# Altium project DOAN1_V2.PrjPcb
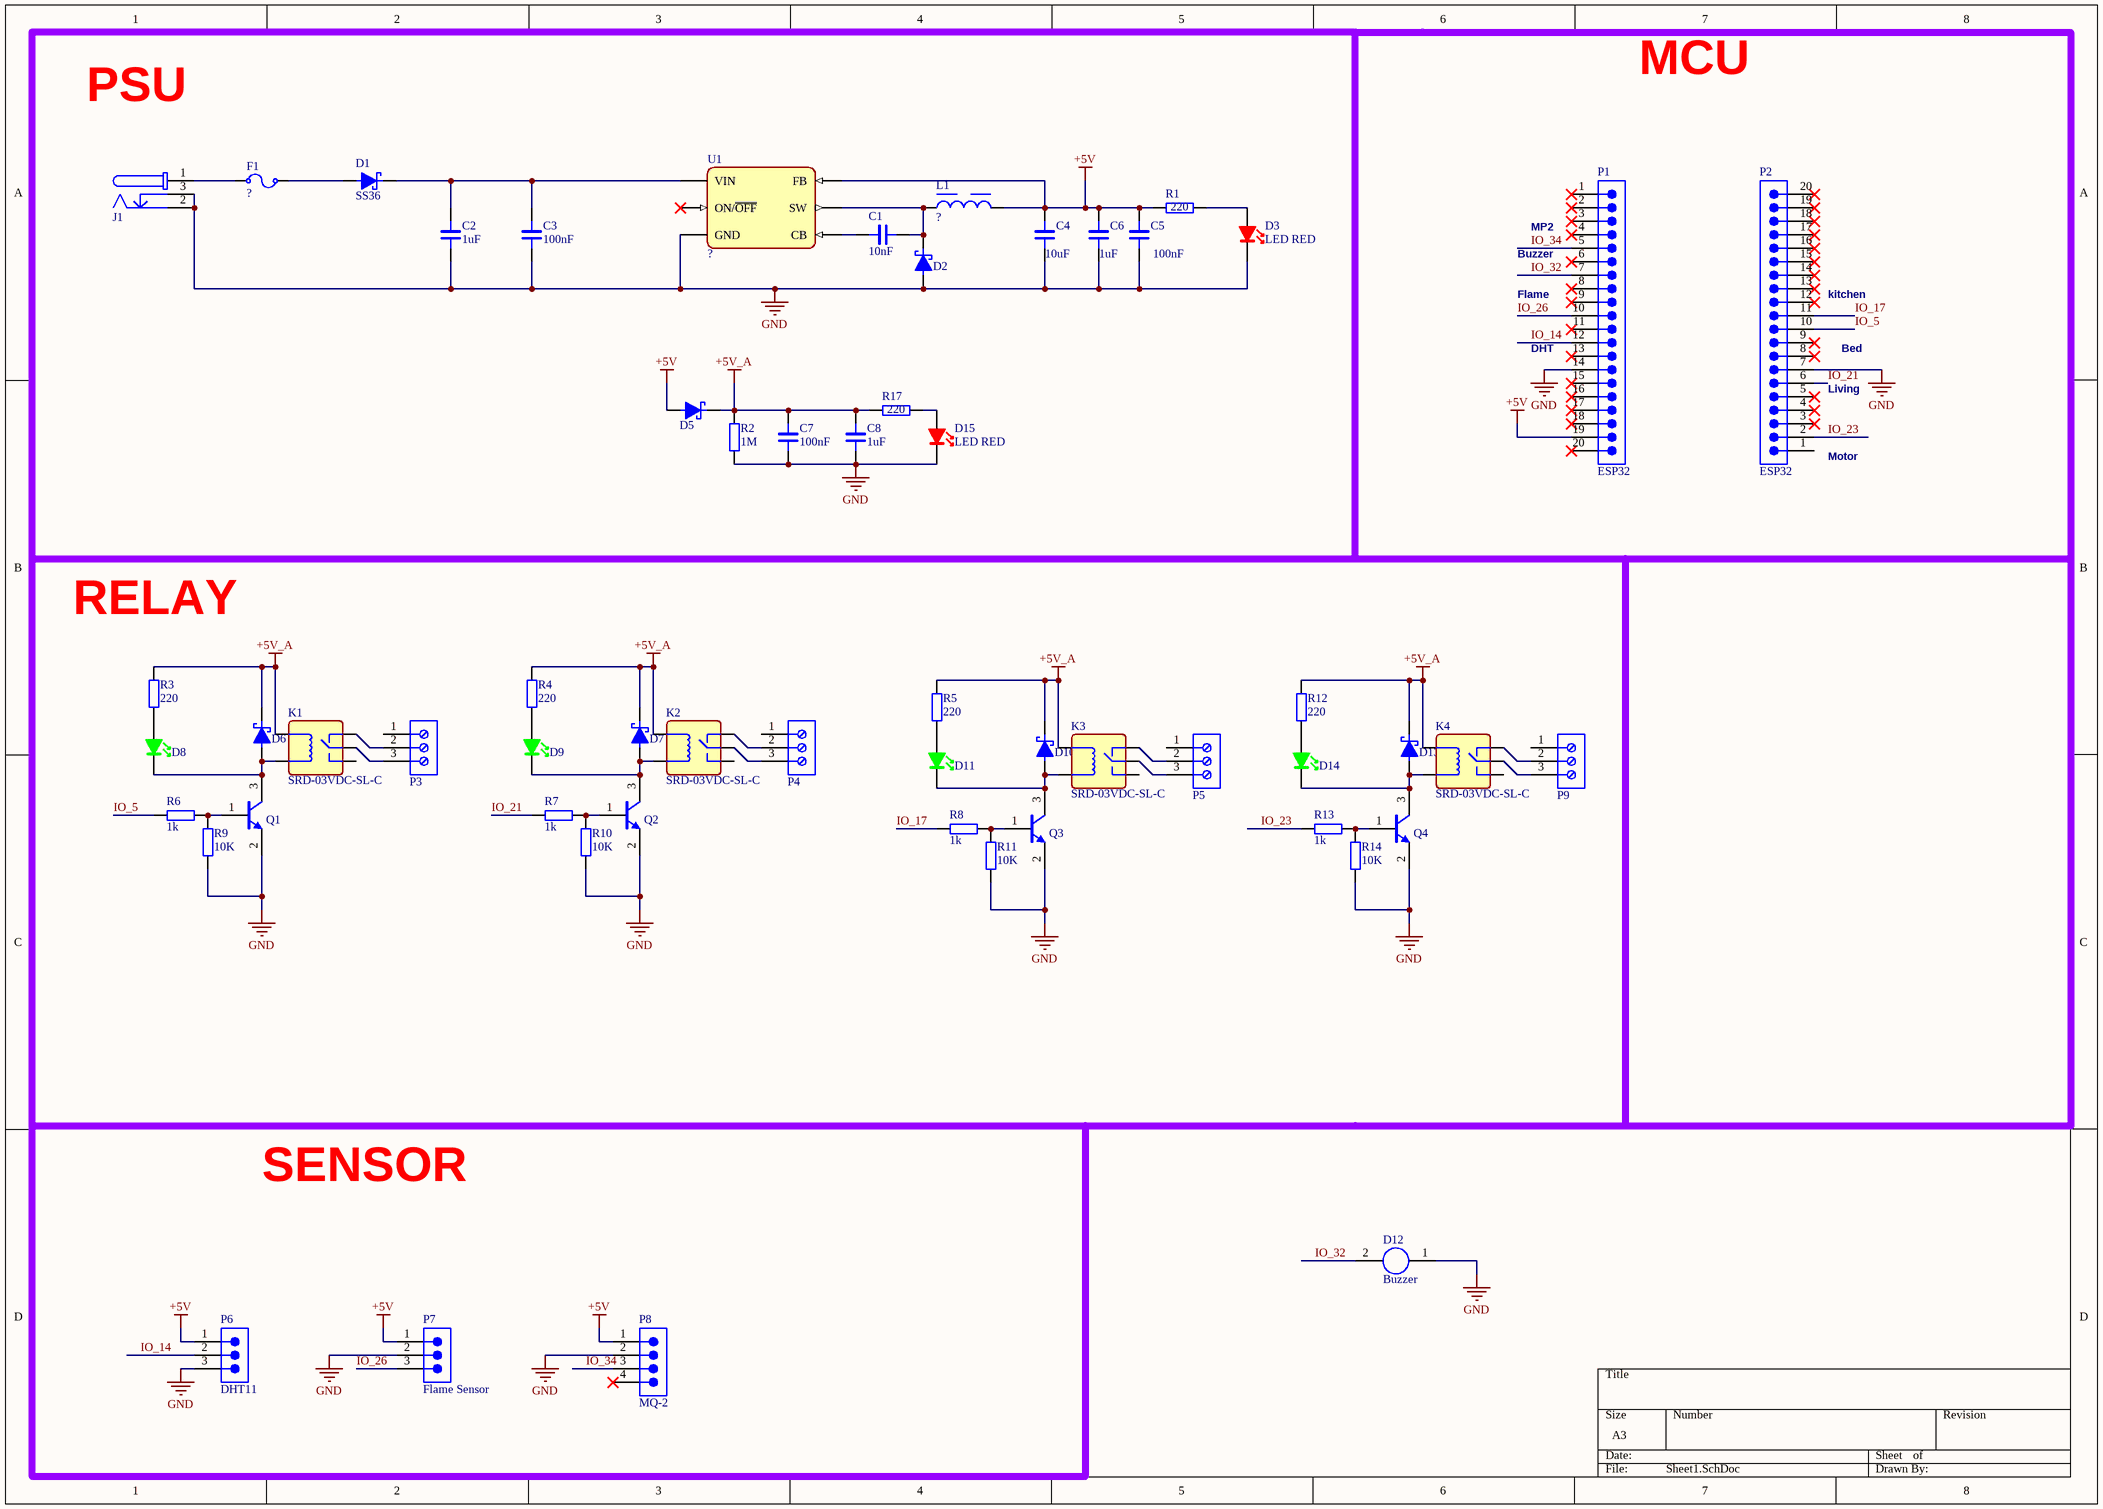
[diagram p0: Sheet1.SchDoc]
1 sheet, 58 parts. Net scope: global (net labels, ports and power ports of the same name join across sheets).
Board file: PCB2.PcbDoc

## Sheet Sheet1.SchDoc
size A3; SheetNumber: 1; SheetTotal: 1

### Parts
C1  10nF  [CAP_0805]
C2  1uF  [CAP_0805]
C3  100nF  [CAP_0805]
C4  10uF  [CAP_0805]
C5  100nF  [CAP_0805]
C6  1uF  [CAP_0805]
C7  100nF  [CAP_0805]
C8  1uF  [CAP_0805]
D1  SS36  [DIO_SMB]
D2  SS34  [DIO-SMA]  (value not drawn)
D3  LED RED  [LED_RED_V0805]
D5  SS34  [DIO_SMA]  (value not drawn)
D6  SS34  [DIO_SMA]  (value not drawn)
D7  SS34  [DIO_SMA]  (value not drawn)
D8  GREEN LED  [LED_GREEN_V0805]  (value not drawn)
D9  GREEN LED  [LED_GREEN_V0805]  (value not drawn)
D10  SS34  [DIO_SMA]  (value not drawn)
D11  GREEN LED  [LED_GREEN_V0805]  (value not drawn)
D12  Buzzer  [PCBComponent_1]
D13  SS34  [DIO_SMA]  (value not drawn)
D14  GREEN LED  [LED_GREEN_V0805]  (value not drawn)
D15  LED RED  [LED_RED_V0805]
F1  ?  [FUS_PPTC0805]
J1  JACK-Power-DC5.5mm  [CON-JACK-PWR-DC550]  (value not drawn)
K1  SRD-03VDC-SL-C  [RLY]
K2  SRD-03VDC-SL-C  [RLY]
K3  SRD-03VDC-SL-C  [RLY]
K4  SRD-03VDC-SL-C  [RLY]
L1  ?  [INDM_7366]
P1  ESP32  [61302011121]
P2  ESP32  [61302011121]
P3  Terminal Block  [CON_03_508_STBRC]  (value not drawn)
P4  Terminal Block  [CON_03_508_STBRC]  (value not drawn)
P5  Terminal Block  [CON_03_508_STBRC]  (value not drawn)
P6  DHT11  [CON -PHD-03254-VSM]
P7  Flame Sensor  [CON -PHD-03254-VSM]
P8  MQ-2  [CON_04_254_VSMBHD]
P9  Terminal Block  [CON_03_508_STBRC]  (value not drawn)
Q1  BC846x  [BJT_ BC846x]  (value not drawn)
Q2  BC846x  [BJT_ BC846x]  (value not drawn)
Q3  BC846x  [BJT_ BC846x]  (value not drawn)
Q4  BC846x  [BJT_ BC846x]  (value not drawn)
R1  220  [RES_0805]
R2  1M  [RES_0805]
R3  220  [RES_0805]
R4  220  [RES_0805]
R5  220  [RES_0805]
R6  1k  [RES_0805]
R7  1k  [RES_0805]
R8  1k  [RES_0805]
R9  10K  [RES_0805]
R10  10K  [RES_0805]
R11  10K  [RES_0805]
R12  220  [RES_0805]
R13  1k  [RES_0805]
R14  10K  [RES_0805]
R17  220  [RES_0805]
U1  ?  [LM2675MX]

### Nets
+5V: C4.2 C5.2 C6.2 D5.A L1.2 P1.19 P6.1 P7.1 P8.1 R1.1 U1.4(FB)
+5V_A: C7.2 C8.2 D5.C D6.C D7.C D10.C D13.C K1.4 K2.4 K3.4 K4.4 R2.1 R3.2 R4.2 R5.2 R12.2 R17.1
GND: C2.1 C3.1 C4.1 C5.1 C6.1 C7.1 C8.1 D2.A D3.C D12.1 D15.C J1.2 J1.3 P1.14 P2.7 P6.3 P7.2 P8.2 Q1.2(E) Q2.2(E) Q3.2(E) Q4.2(E) R2.2 R9.2 R10.2 R11.2 R14.2 U1.6(GND)
IO_5: P2.10 R6.2
IO_14: P1.12 P6.2
IO_17: P2.11 R8.2
IO_21: P2.6 R7.2
IO_23: P2.2 R13.2
IO_26: P1.10 P7.3
IO_32: D12.2 P1.7
IO_34: P1.5 P8.3
NetC1_1: C1.1 U1.1(CB)
NetC1_2: C1.2 D2.C L1.1 U1.8(SW)
NetC2_2: C2.2 C3.2 D1.C U1.7(VIN)
NetD1_A: D1.A F1.1
NetD3_A: D3.A R1.2
NetD6_A: D6.A D8.C K1.1 Q1.3(C)
NetD7_A: D7.A D9.C K2.1 Q2.3(C)
NetD8_A: D8.A R3.1
NetD9_A: D9.A R4.1
NetD10_A: D10.A D11.C K3.1 Q3.3(C)
NetD11_A: D11.A R5.1
NetD13_A: D13.A D14.C K4.1 Q4.3(C)
NetD14_A: D14.A R12.1
NetD15_A: D15.A R17.2
NetF1_1: F1.1 J1.1
NetK1_3: K1.3 P3.3
NetK1_5: K1.5 P3.2
NetK2_3: K2.3 P4.3
NetK2_5: K2.5 P4.2
NetK3_3: K3.3 P5.3
NetK3_5: K3.5 P5.2
NetK4_3: K4.3 P9.3
NetK4_5: K4.5 P9.2
NetQ1_1: Q1.1(B) R6.1 R9.1
NetQ2_1: Q2.1(B) R7.1 R10.1
NetQ3_1: Q3.1(B) R8.1 R11.1
NetQ4_1: Q4.1(B) R13.1 R14.1

Not connected (* = marked no-connect by the designer): K1 2; K2 2; K3 2; K4 2; P1 1* 2* 3* 4* 6* 8* 9* 11* 13* 15* 16* 17* 18* 20*; P2 1 3* 4* 5* 8* 9* 12* 13* 14* 15* 16* 17* 18* 19* 20*; P3 1; P4 1; P5 1; P8 4*; P9 1; U1 5(ON/~{OFF})*

### Notes on the sheet
- PSU
- MCU
- (near P1) MP2
- (near P1) Flame
- (near P1) Buzzer
- (near P2) kitchen
- (near P1) DHT
- Bed
- (near P2) Living
- (near P2) Motor
- RELAY
- SENSOR

### Library data of the parts
C1-C8 = CAP_0805: 0805 Multilayer Ceramic Capacitors MLCC - SMD/SMT ROHS; LCSC Part: ?; JLCPCB Part: ?; Mfr. Part: ?; Voltage: ?
  C1: Value: 10nF
  C2 C6 C8: Value: 1uF
  C3 C5 C7: Value: 100nF
  C4: Value: 10uF
D1 = DIO_SS36: 60V 3A 700mV@3A SMB Schottky Barrier Diodes; Mrf. Part: ?; LCSC Part: ?; JLCPCB Part: ?
D2 = DIO-SS34: 40V 500mV@3A 3A SMC (SBD); Mfr. Part: ?; DigiKey Part: ?; LCSC Part: ?; Mouser Part: ?
D3 D15 = LED_RED_V0805: 20mA 615nm~630nm RED; JLCPCB Part: ?; LCSC Part: ?; Mrf. Part: ?
D5-D7 D10 D13 = DIO_SS34: 40V 500mV@3A 3A SMC (SBD); Mfr. Part: ?; JLCPCB Part: ?; LCSC Part: ?
D8 D9 D11 D14 = LED_GREEN_V0805: 20mA 615nm~630nm GREEN; JLCPCB Part: ?; LCSC Part: ?; Mrf. Part: ?
D12 = Component_1
F1 = FUS-PPTC0805: 0805 Resettable Fuses; Mouser Part: ?; LCSC Part: ?; Mfr. Part: ?; Hold Current: ?; Trip Current: ?; DigiKey Part: ?
J1 = CON-JACK-PWR-DC550: DC Power Jack Right Angled THT 5.5mmx2.1mm; Mrf. Part: ?; LCSC Part: ?; JLCPCB Part: ?
K1-K4 = RLY
L1 = INDM_7366: (7.30mmx6.60mm) Shielded Molded Inductor; Value: ?; Mouser Part: ?; LCSC Part: ?; Mfr. Part: ?; Current Rating: ?; Digiley Part: ?
P1 P2 = CMP-1502-01102-3: NexarPartId: 32855554; Operating Supply Voltage: 250V; Gender: Male; Current Rating: 3A; Contact Resistance: 20mΩ; Number of Contacts: 20; Pitch: 2.54mm; Connector Type: Male Pin; RoHS: Compliant; Contact Plating: Gold; REACH SVHC: Unknown; Packaging: Bulk; Lead Pitch: 2.54mm; Mount: Through Hole; Termination: Solder; Number of Pins: 20; Contact Mating Length: 5.9944mm; Number of Rows: 1; Color: Black; Contact Material: Copper; Orientation: Vertical; Number of Positions: 20
P3-P5 P9 = CON_03_508_STBRC: 5.08 mm Horizontal Entry Modular w. Rising Cage Clamp; Mfr. Part: ?; JLCPCB Part: ?; LCSC Part: ?
P6 P7 = CON -PHD-03254-VSM: 3P 2.54mm Vertical Pin Header; Mrf. Part: ?; LCSC Part: ?; JLCPCB Part: ?
P8 = CON_04_254_VSMBHD: 2.54mm 4P Male Vertical Shrouded Header; Mrf. Part: ?; LCSC Part: ?; JLCPCB Part: ?
Q1-Q4 = BJT_ BC846x: Single Bipolar Transistor, NPN, 65 V, 100 mA, 250 mW, SOT23 (TO-236AB), 3 Pins, Surface Mount; Mrf. Part: ?; LCSC Part: ?; JLCPCB Part: ?
R1-R14 R17 = RES_0805: 0805 Thick Film Resistor - Surface Mount ROHS; Mfr. Part: ?; LCSC Part: ?; JLCPCB Part: ?
  R1 R3-R5 R12 R17: Value: 220
  R2: Value: 1M
  R6-R8 R13: Value: 1k
  R9-R11 R14: Value: 10K
U1 = LM2675MX: Buck Converter, 6.5V-40V-3A, 8-Pin SOIC; Mfr. Part: LM2675MX; LCSC Part: ?; Mouser Part: ?; Value: ?; DigiKey Part: ?